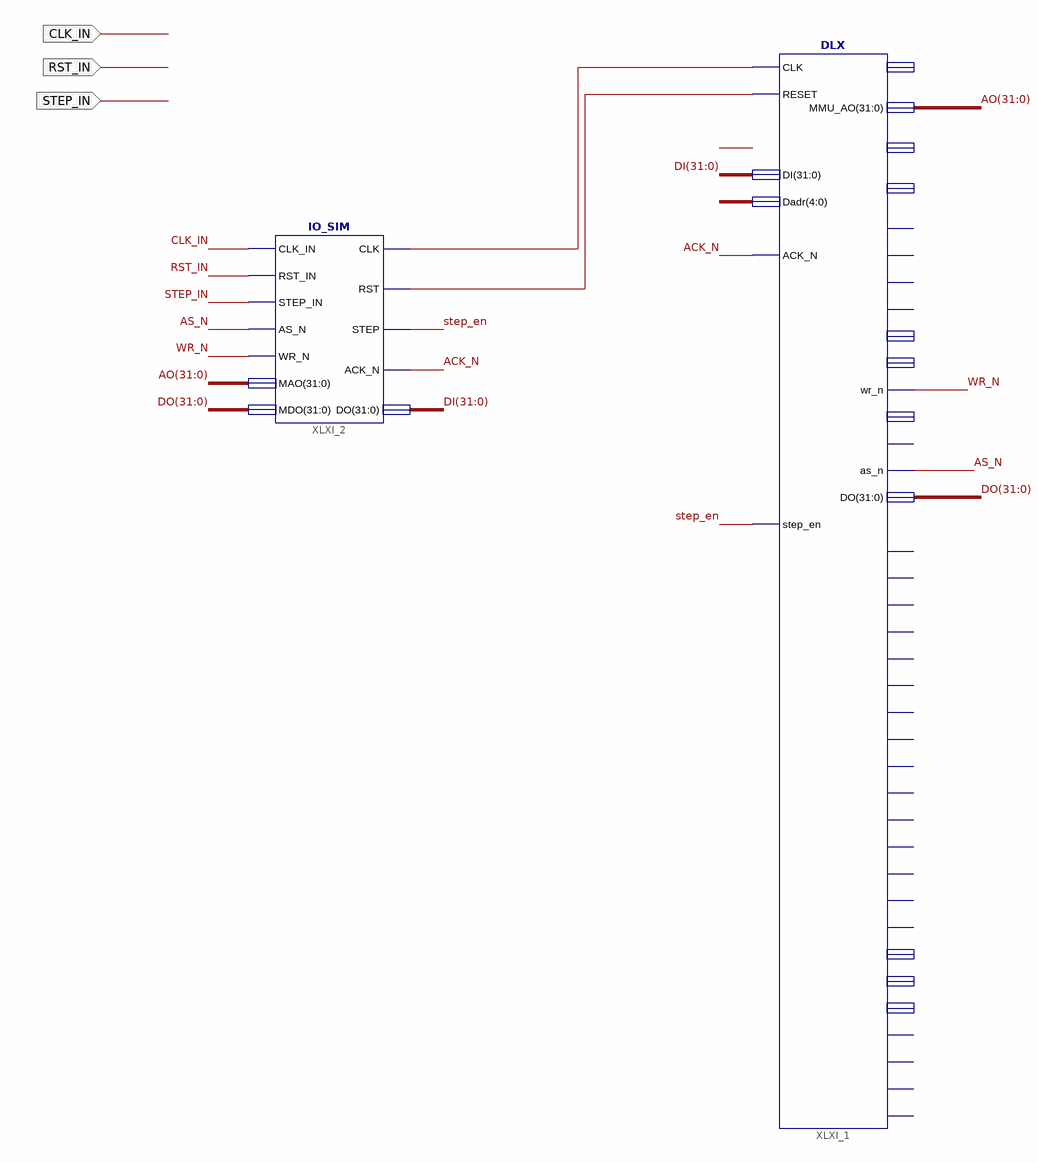
[diagram p0: schematic sheet 1]
// Xilinx ISE schematic DLX_IOSIMUL.sch (spartan6) as structural Verilog: 2 symbols, 3 ports
module DLX_IOSIMUL (
  input  CLK_IN,
  input  RST_IN,
  input  STEP_IN
);

  wire ACK_N, AS_N, step_en, WR_N, XLXN_36, XLXN_48, XLXN_49;
  wire [4:0] XLXN_38;
  wire [31:0] AO, DI, DO;

  IO_SIM XLXI_2 (
    .CLK_IN(CLK_IN), .RST_IN(RST_IN), .STEP_IN(STEP_IN), .AS_N(AS_N), .WR_N(WR_N), .MAO(AO), .MDO(DO),
    .CLK(XLXN_48), .RST(XLXN_49), .STEP(step_en), .ACK_N(ACK_N), .DO(DI));
  DLX XLXI_1 (
    .CLK(XLXN_48), .RESET(XLXN_49), .DI(DI), .Dadr(XLXN_38), .step_en(step_en), .ACK_N(ACK_N), .MMU_AO(AO),
    .wr_n(WR_N), .as_n(AS_N), .DO(DO), .busy(XLXN_36));  // open: AEQZ, add, test, shift, right, Ace, Bce, Cce, PCce, MDRce, MDRsel, MARce, DINce, Asel, IRce, func, D, opcode, S1SEL, S2SEL, Itype, jlink, init, halt, ALUF, DLX_STATE, MAC_STATE, stop_n, IR, GPRwe, MR, MW
endmodule
